# Altium schematic sheet Display.SchDoc: Access Control
size A; DrawnBy: Q.Thang & T.Khoa; Revision: V1.0.1; SheetNumber: 10; SheetTotal: 16
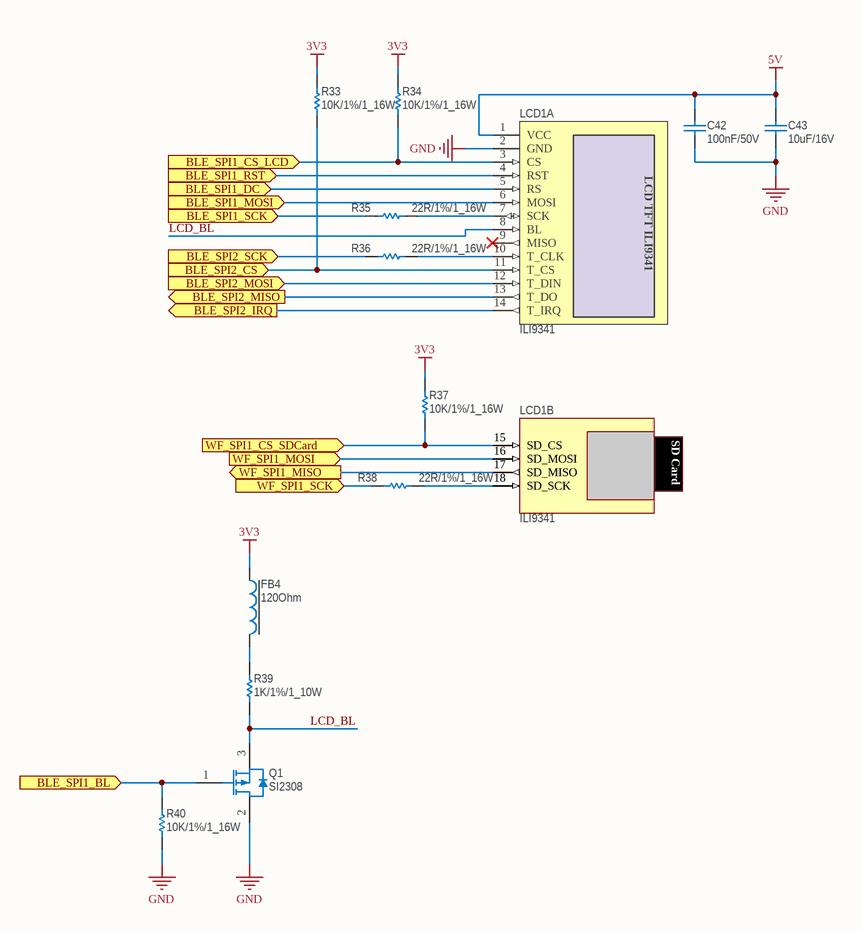
[diagram p0: Display.SchDoc]

## Parts
C42  100nF/50V  [CAP_0603]
C43  10uF/16V  [CAP_0603]
FB4  120Ohm  [Ferrite_Bead_0805]
LCD1  ILI9341  [LCD_TFT_ILI9341_3.2]  (parts A,B of 2)
Q1  SI2308  [SOT-23]
R33  10K/1%/1_16W  [RESISTOR_0402]
R34  10K/1%/1_16W  [RESISTOR_0402]
R35  22R/1%/1_16W  [RESISTOR_0402]
R36  22R/1%/1_16W  [RESISTOR_0402]
R37  10K/1%/1_16W  [RESISTOR_0402]
R38  22R/1%/1_16W  [RESISTOR_0402]
R39  1K/1%/1_10W  [Resistor_0603]
R40  10K/1%/1_16W  [RESISTOR_0402]

## Ports
BLE_SPI1_BL (in, see Overview_Schematic[4C], ESP32_BLE[3B]), BLE_SPI1_CS_LCD (in, see Overview_Schematic[3C], ESP32_BLE[4B]), BLE_SPI1_DC (in, see Overview_Schematic[3C], ESP32_BLE[3B]), BLE_SPI1_MOSI (in, see Overview_Schematic[3C], ESP32_BLE[3B]), BLE_SPI1_RST (in, see Overview_Schematic[3C], ESP32_BLE[2B]), BLE_SPI1_SCK (in, see Overview_Schematic[3C], ESP32_BLE[3B]), BLE_SPI2_CS (in, see Overview_Schematic[3C], ESP32_BLE[3B]), BLE_SPI2_IRQ (out, see Overview_Schematic[3C], ESP32_BLE[3B]), BLE_SPI2_MISO (out, see Overview_Schematic[3C], ESP32_BLE[3B]), BLE_SPI2_MOSI (in, see Overview_Schematic[3C], ESP32_BLE[3B]), BLE_SPI2_SCK (in, see Overview_Schematic[3C], ESP32_BLE[4B]), WF_SPI1_CS_SDCard (in, see Overview_Schematic[5C], ESP32_WiFi[3B]), WF_SPI1_MISO (out, see Overview_Schematic[5C], ESP32_WiFi[2B]), WF_SPI1_MOSI (in, see Overview_Schematic[5C], DAC_ADC_External[1C], ESP32_WiFi[2B]), WF_SPI1_SCK (in, see Overview_Schematic[5C], DAC_ADC_External[1C], ESP32_WiFi[2B])

## Nets
3V3: FB4.1 R33.2 R34.2 R37.2
5V: C42.2 C43.2 LCD1.1(VCC)
GND: C42.1 C43.1 LCD1.2(GND) Q1.2(SOURCE) R40.1
BLE_SPI1_BL: Q1.1(GATE) R40.2 ; port BLE_SPI1_BL
BLE_SPI1_CS_LCD: LCD1.3(CS) R34.1 ; port BLE_SPI1_CS_LCD
BLE_SPI1_DC: LCD1.5(RS) ; port BLE_SPI1_DC
BLE_SPI1_MOSI: LCD1.6(MOSI) ; port BLE_SPI1_MOSI
BLE_SPI1_RST: LCD1.4(RST) ; port BLE_SPI1_RST
BLE_SPI1_SCK: R35.1 ; port BLE_SPI1_SCK
BLE_SPI2_CS: LCD1.11(T_CS) R33.1 ; port BLE_SPI2_CS
BLE_SPI2_IRQ: LCD1.14(T_IRQ) ; port BLE_SPI2_IRQ
BLE_SPI2_MISO: LCD1.13(T_DO) ; port BLE_SPI2_MISO
BLE_SPI2_MOSI: LCD1.12(T_DIN) ; port BLE_SPI2_MOSI
BLE_SPI2_SCK: R36.1 ; port BLE_SPI2_SCK
LCD_BL: LCD1.8(BL) Q1.3(DRAIN) R39.1
WF_SPI1_CS_SDCard: LCD1.15(SD_CS) R37.1 ; port WF_SPI1_CS_SDCard
WF_SPI1_MISO: LCD1.17(SD_MISO) ; port WF_SPI1_MISO
WF_SPI1_MOSI: LCD1.16(SD_MOSI) ; port WF_SPI1_MOSI
WF_SPI1_SCK: R38.1 ; port WF_SPI1_SCK
NetFB4_2: FB4.2 R39.2
NetLCD1_7: LCD1.7(SCK) R35.2
NetLCD1_10: LCD1.10(T_CLK) R36.2
NetLCD1_18: LCD1.18(SD_SCK) R38.2

Not connected (* = marked no-connect by the designer): LCD1 9(MISO)*

## Notes on the sheet
- Project Name
- Size
- A4
- Revision
- Checked By:
- Drawn By:
- Date:
- File:
- Last Modified:
- Sheet
- of
- (in symbol LCD TFT, part A) LCD TFT ILI9341
- (in symbol LCD TFT, part B) SD Card

## Library data of the parts
C42 = Ceramic_Cap_100nF_50V_0603: CAP, size 0603, 100nF, 50V; Supply Part Number: Tụ Gốm 0603 100nF (0.1uF) 50V; Supply Name: Thegioiic; Datasheet: *; Supply URL: https://www.thegioiic.com/tu-gom-0603-100nf-0-1uf-50v
C43 = Ceramic_Cap_10uF_16V_0603: CAP, size 0603, 10uF, 16V; Supply Part Number: Tụ Gốm 0603 10uF 16V; Supply Name: Thegioiic; Datasheet: *; Supply URL: https://www.thegioiic.com/tu-gom-0603-10uf-16v
FB4 = Ferrite_Bead_120Ohm_2A_0805: Ferrite Bead, size 0805, 120Ohm, 2A; Supply Part Number: CBW201209U121T Ferrite Beads 2A 120 Ohm 0805; Supply Name: Thegioiic; Supply URL: https://www.thegioiic.com/cbw201209u121t-ferrite-beads-2a-120-ohm-0805
LCD1 = LCD TFT: Supply Part Number: LCD 3.2inch 320x240 TFT ILI9341 Cảm Ứng Điện Trở SPI; Supply Name: Thegioiic; Supply URL: https://www.thegioiic.com/lcd-3-2inch-320x240-tft-ili9341-cam-ung-dien-tro-spi
Q1 = SI2308: SI2308 SOT23 MOSFET N-CH 2A 60V; Supply Name: BanLinhKien; Datasheet: https://www.mouser.vn/datasheet/2/427/si2308bd-1765649.pdf; Supply Part Number: SI2308 SOT23 MOSFET N-CH 2A 60V; Supply URL: https://banlinhkien.com/si2308-sot23-mosfet-nch-2a-60v-smda8s-5c-p15289840.html
R33 R34 R37 R40 = Res_10K_0402_1%: Resistor 0402 10KOhm 1% 1_16W; Supply Part Number: Điện Trở 10 KOhm 0402 1%; Supply Name: Thegioiic; Supply URL: https://www.thegioiic.com/dien-tro-10-kohm-0402-1-
R35 R36 R38 = Res_22R_0402_1%: Resistor 0402 22 Ohm 1% 1_16W; Supply Name: *; Supply Part Number: *; Supply URL: *
R39 = Res_1K_0603_1%: Resistor 0603 1KOhm 1% 1_10W; Supply Part Number: Điện Trở 1 KOhm 0603 1%; Supply Name: Thegioiic; Supply URL: https://www.thegioiic.com/dien-tro-1-kohm-0603-1-